# EAGLE schematic SmartGarden Master v1.5 (EAGLE 6.5.0)
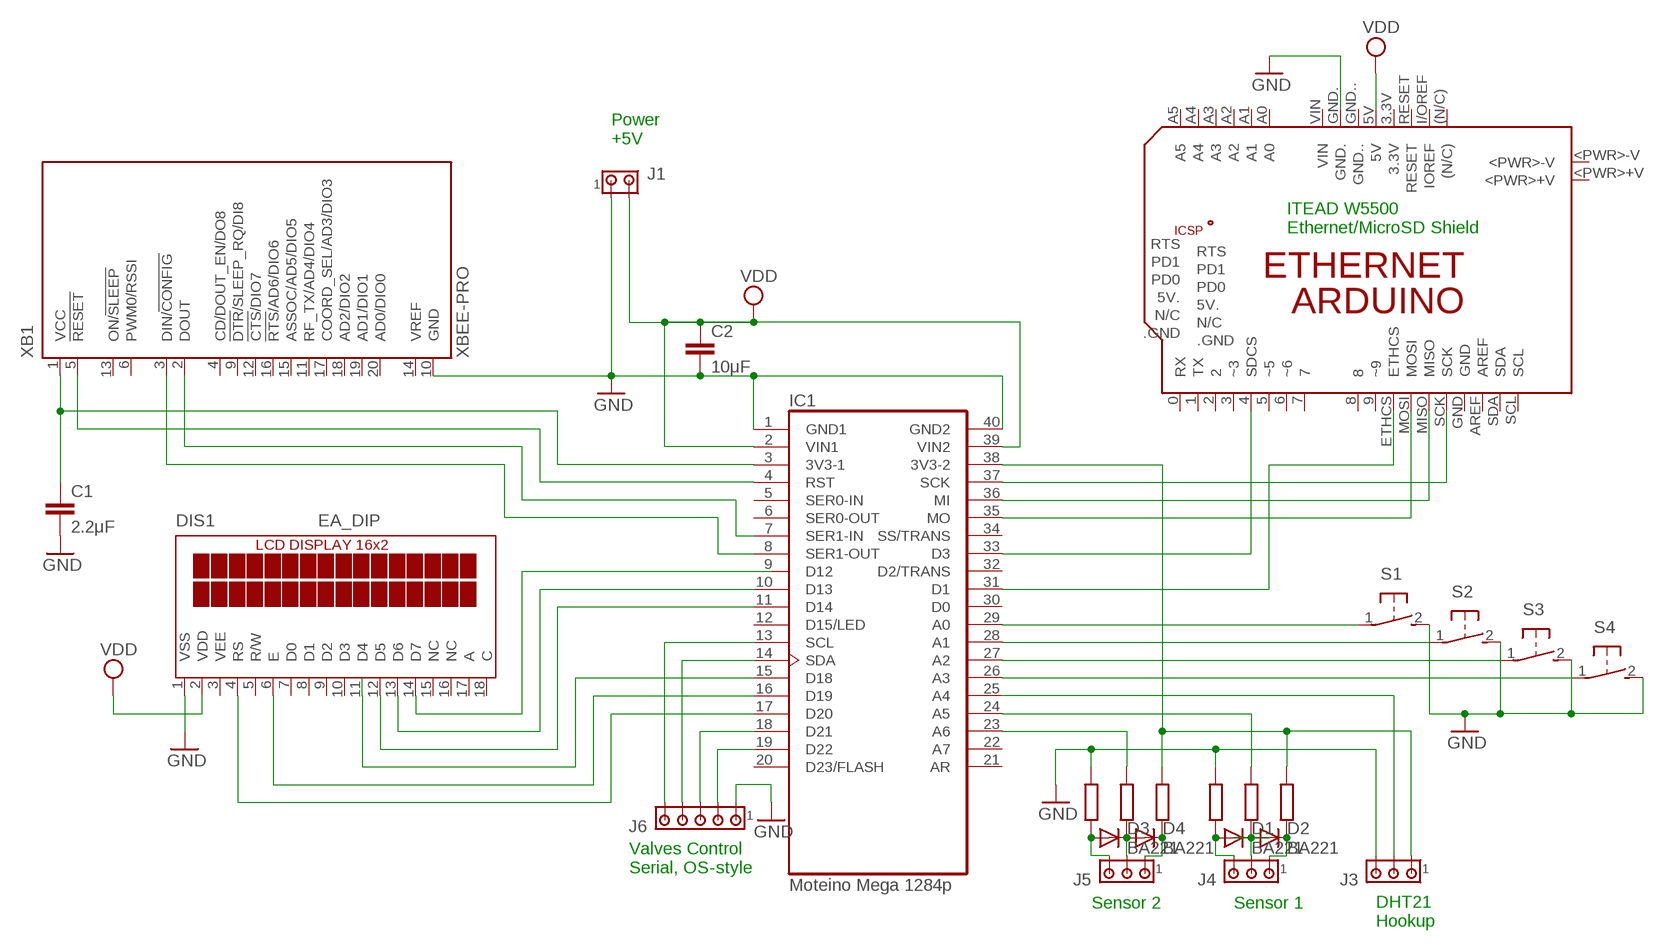
[diagram p0: schematic, sheet 1]

## Parts
C1  2.2μF  C-EU050-055X075  [C050-055X075]
C2  10μF  C-EU050-035X075  [C050-035X075]
D1  BA221  [DO35-10]
D2  BA221  [DO35-10]
D3  BA221  [DO35-10]
D4  BA221  [DO35-10]
DIS1  EA_DIP  [EA_DIP]
IC1  Moteino Mega 1284p  MOTEINO_MEGA  [DIL40]
J1  MTA02-156  [1X2MTA]
J3  MTA03-156  [1X3MTA]
J4  MTA03-156  [1X3MTA]
J5  MTA03-156  [1X3MTA]
J6  MTA05-100  [10X05MTA]
PCB1  ARDUINO_ETHERNET  [ARDUINO_ETHERNET]
S1  31-XX  [B3F-31XX]
S2  31-XX  [B3F-31XX]
S3  31-XX  [B3F-31XX]
S4  31-XX  [B3F-31XX]
XB1  XBEE-PRO  [XBEE-PRO]

## Nets
GND: C1.2 C2.2 DIS1.1(VSS) IC1.1(GND1) IC1.40(GND2) J1.1 J3.3 J6.1 PCB1.GND. S1.2(S) S2.2(S) S3.2(S) S4.2(S) XB1.10(GND)
N$1: DIS1.14(D7)
N$2: C1.1 IC1.3(3V3-1) XB1.1(VCC)
N$3: IC1.4(RST) XB1.5(!RESET)
N$4: IC1.8(SER1-OUT) XB1.3(DIN/!CONFIG)
N$5: D3.C D4.A J5.2
N$6: IC1.19(D22) J6.2
N$7: IC1.18(D21) J6.3
N$8: IC1.14(SDA) J6.4
N$9: IC1.13(SCL) J6.5
N$10: DIS1.11(D4) IC1.15(D18)
N$11: DIS1.13(D6) IC1.10(D13)
N$12: DIS1.12(D5) IC1.11(D14)
N$13: IC1.29(A0) S1.1(P)
N$14: IC1.28(A1) S2.1(P)
N$15: IC1.27(A2) S3.1(P)
N$16: IC1.26(A3) S4.1(P)
N$17: IC1.24(A5)
N$18: IC1.23(A6)
N$19: IC1.7(SER1-IN) XB1.2(DOUT)
N$20: DIS1.6(E) IC1.16(D19)
N$21: DIS1.4(RS) IC1.17(D20)
N$22: IC1.37(SCK) PCB1.SCK
N$24: IC1.36(MI) PCB1.MISO
N$25: IC1.35(MO) PCB1.MOSI
N$26: IC1.33(D3) PCB1.4(SDCS)
N$27: IC1.31(D1) PCB1.ETHCS
N$28: D1.C D2.A J4.2
N$29: D1.A J4.3
N$30: D2.C J4.1
N$31: D3.A J5.3
N$32: D4.C J5.1
N$33: IC1.25(A4) J3.2
N$34: IC1.38(3V3-2) J3.1
VDD: C2.1 DIS1.2(VDD) IC1.2(VIN1) IC1.39(VIN2) J1.2 PCB1.5V
Unconnected: DIS1.5(R/W) DIS1.7(D0) DIS1.8(D1) DIS1.9(D2) DIS1.10(D3) DIS1.15(NC) DIS1.16(NC) DIS1.17(A) DIS1.18(C) IC1.5(SER0-IN) IC1.6(SER0-OUT) IC1.9(D12) IC1.12(D15/LED) IC1.20(D23/FLASH) IC1.21(AR) IC1.22(A7) IC1.30(D0) IC1.32(D2/TRANS) IC1.34(SS/TRANS) PCB1.0(RX) PCB1.1(TX) PCB1.2 PCB1.3(~3) PCB1.3.3V PCB1.5(~5) PCB1.5V. PCB1.6(~6) PCB1.7 PCB1.8 PCB1.9(~9) PCB1.(N/C) PCB1.+5V. PCB1..GND PCB1.<PWR>+V PCB1.<PWR>-V PCB1.A0 PCB1.A1 PCB1.A2 PCB1.A3 PCB1.A4 PCB1.A5 PCB1.AREF PCB1.GND PCB1.GND.. PCB1.GND_ PCB1.I/OREF(IOREF) PCB1.MISO. PCB1.MOSI. PCB1.N/C PCB1.PD0 PCB1.PD1 PCB1.RESET PCB1.RESET. PCB1.RTS PCB1.SCK. PCB1.SCL PCB1.SDA PCB1.VIN XB1.4(CD/DOUT_EN/DO8) XB1.6(PWM0/RSSI) XB1.9(!DTR!/SLEEP_RQ/DI8) XB1.11(RF_TX/AD4/DIO4) XB1.12(!CTS!/DIO7) XB1.13(ON/!SLEEP) XB1.14(VREF) XB1.15(ASSOC/AD5/DIO5) XB1.16(!RTS!/AD6/DIO6) XB1.17(COORD_SEL/AD3/DIO3) XB1.18(AD2/DIO2) XB1.19(AD1/DIO1) XB1.20(AD0/DIO0)

## Notes on the sheet
- Power
  +5V
- ITEAD W5500
  Ethernet/MicroSD Shield
- Valves Control
  Serial, OS-style
- Sensor 2 | Sensor 1
- DHT21
  Hookup

## Power pins joined to a net without a drawn wire
VEE: DIS1.3(VEE)

## Library data of the parts
C1 C2 = resistor:C-EU: CAPACITOR, European symbol
D1-D4 = diode:BA221: DIODE high speed (Philips)
DIS1 = display-lcd:EA_DIP: LCD-MODUL 2x16 - 6,68mm, INKL. KONTROLLER HD44780 Source: Data sheet <http://www.lcd-module.de/pdf/doma/dip162-d.pdf>
IC1 = SmartGarden:MOTEINO_MEGA: Moteino Mega
J1 = con-amp:MTA02-156: AMP connector
J3-J5 = con-amp:MTA03-156: AMP connector
J6 = con-amp:MTA05-100: AMP connector
PCB1 = E14_Arduino_revB:ARDUINO_ETHERNET: Device for representing an Arduino Ethernet board with a footprint in an EAGLE design. Created by Dave Young for Element14. More EAGLE documentation at: http://www.element14.com/community/community/knode/cadsoft_eagle
S1-S4 = switch-omron:31-XX: OMRON SWITCH; MPN: B3F-3100; OC_FARNELL: 959704; OC_NEWARK: 36M3582
XB1 = maxstream:XBEE: XBee (TM) /XBee-PRO(TM) OEM RF Modules Source: MaxStream, Inc. xbee_productmanual.pdf; MPN: XBP24-AWI-001; OC_FARNELL: 1337916; OC_NEWARK: 42M2667